# Altium schematic sheet XC6SLX09-2FTG256C.SchDoc
size A3
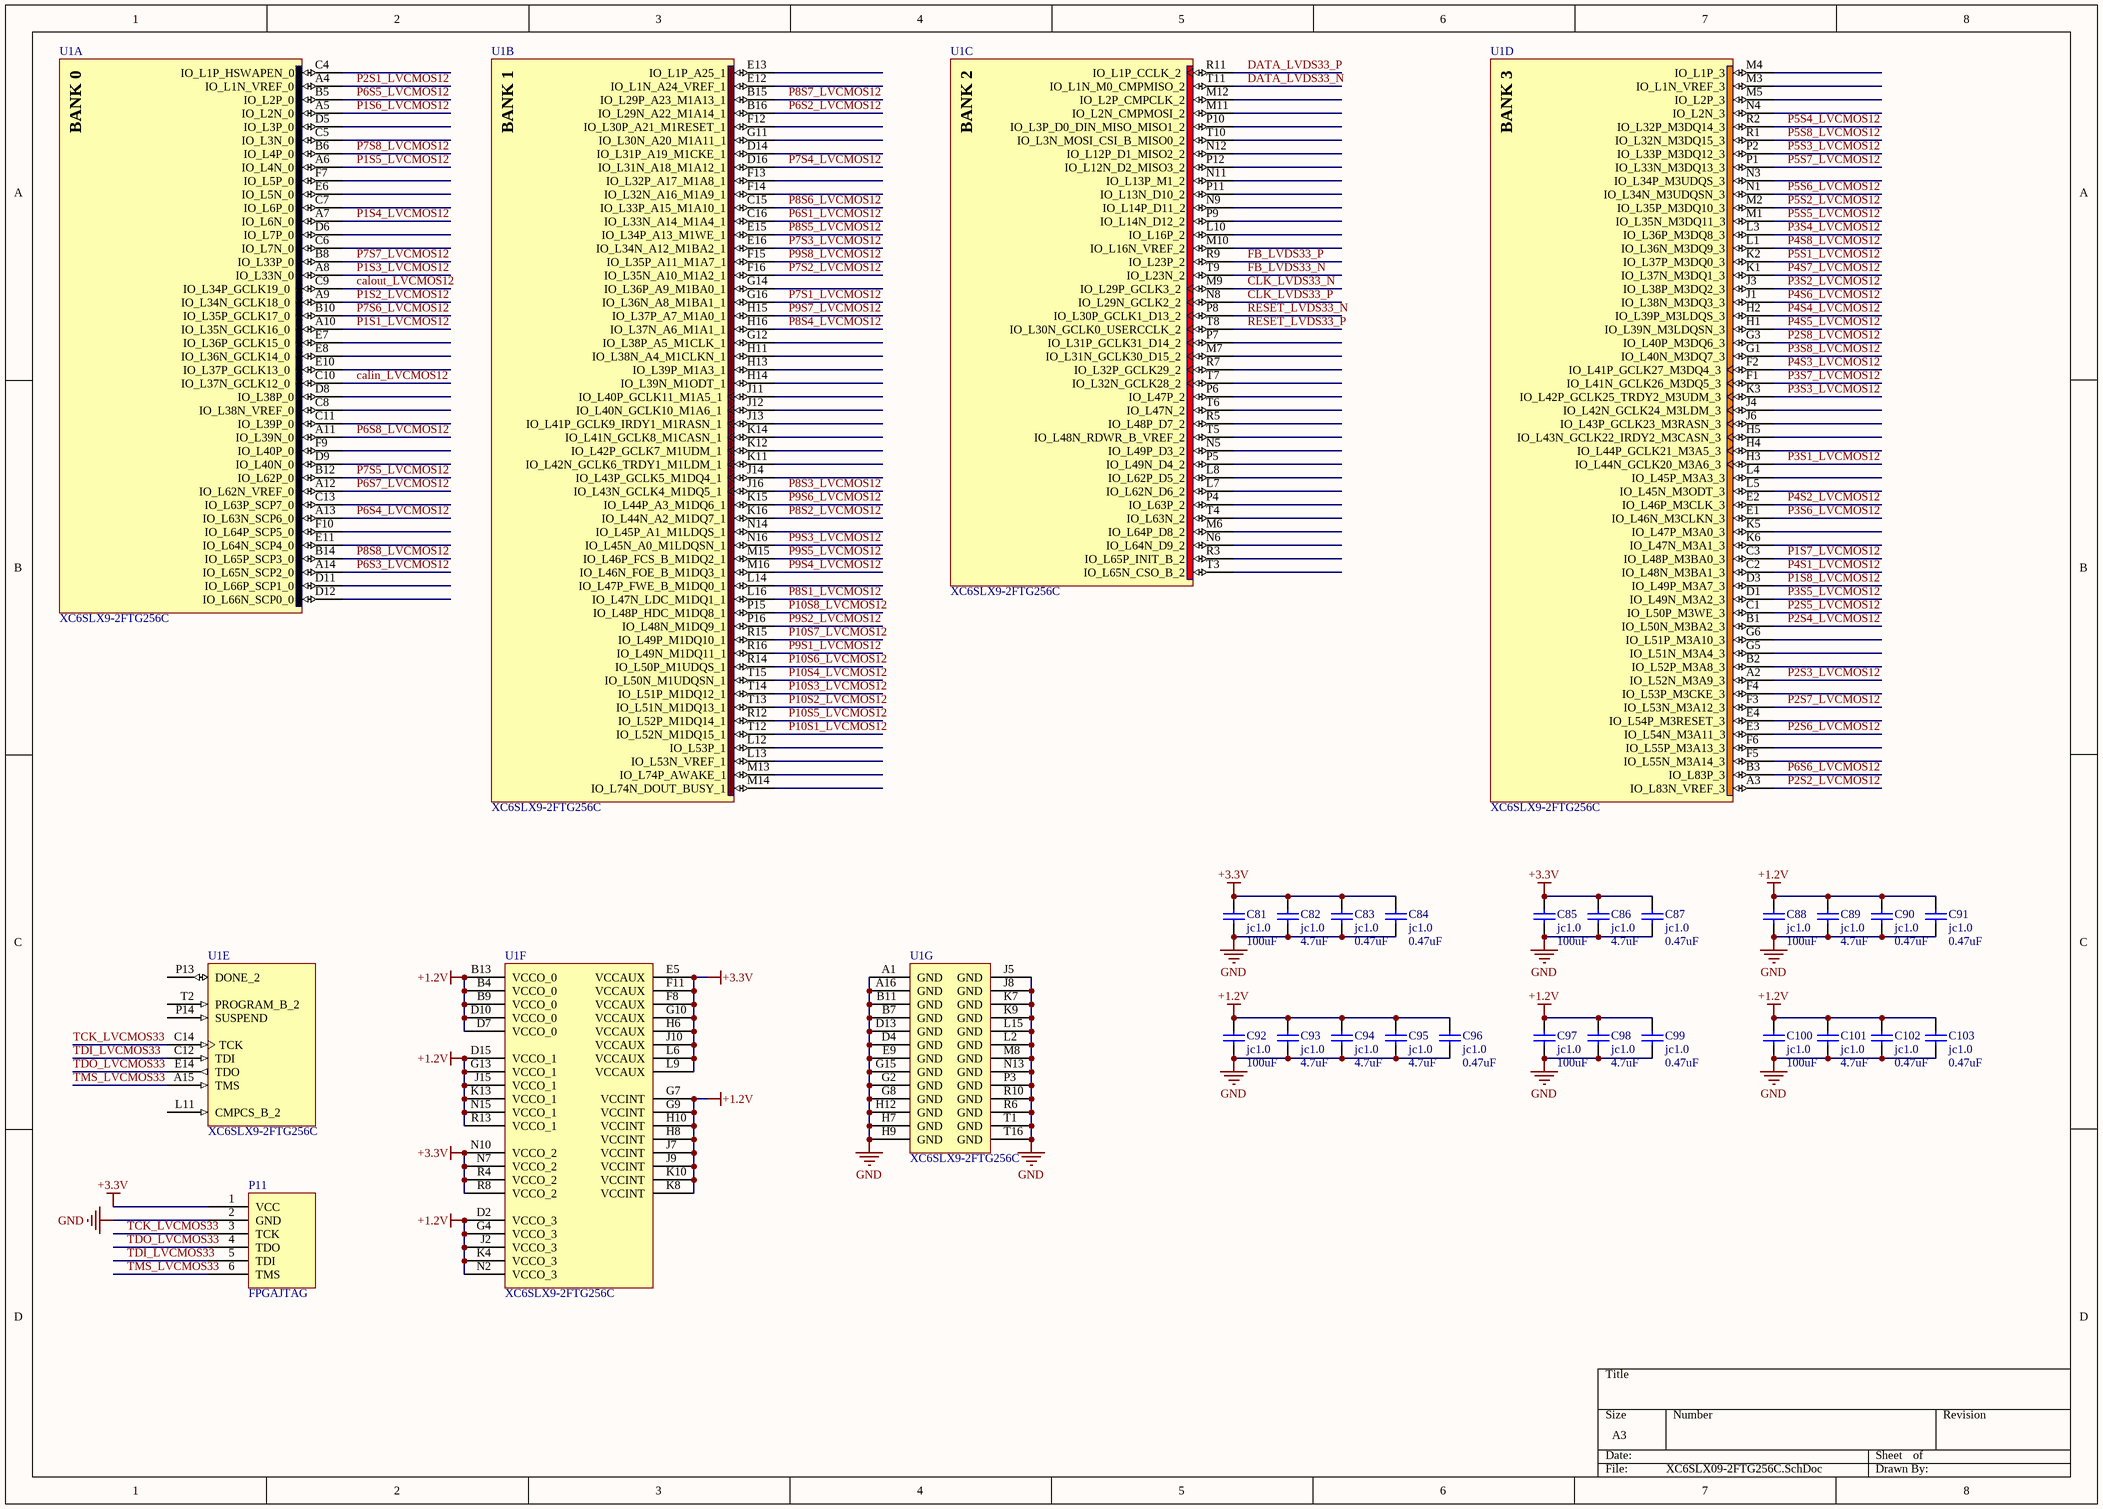
[diagram p0: XC6SLX09-2FTG256C.SchDoc]

## Parts
C81  jc1.0  value 100uF  [0805]
C82  jc1.0  value 4.7uF  [0402]
C83  jc1.0  value 0.47uF  [0402]
C84  jc1.0  value 0.47uF  [0402]
C85  jc1.0  value 100uF  [0805]
C86  jc1.0  value 4.7uF  [0402]
C87  jc1.0  value 0.47uF  [0402]
C88  jc1.0  value 100uF  [0805]
C89  jc1.0  value 4.7uF  [0402]
C90  jc1.0  value 0.47uF  [0402]
C91  jc1.0  value 0.47uF  [0402]
C92  jc1.0  value 100uF  [0805]
C93  jc1.0  value 4.7uF  [0402]
C94  jc1.0  value 4.7uF  [0402]
C95  jc1.0  value 4.7uF  [0402]
C96  jc1.0  value 0.47uF  [0402]
C97  jc1.0  value 100uF  [0805]
C98  jc1.0  value 4.7uF  [0402]
C99  jc1.0  value 0.47uF  [0402]
C100  jc1.0  value 100uF  [0805]
C101  jc1.0  value 4.7uF  [0402]
C102  jc1.0  value 0.47uF  [0402]
C103  jc1.0  value 0.47uF  [0402]
P11  FPGAJTAG  [SIP6]
U1  XC6SLX9-2FTG256C  [FTG256]  (parts A,B,C,D,E,F,G of 7)

## Nets
+1.2V: C88.2 C89.2 C90.2 C91.2 C92.2 C93.2 C94.2 C95.2 C96.2 C97.2 C98.2 C99.2 C100.2 C101.2 C102.2 C103.2 U1.B4(VCCO_0) U1.B9(VCCO_0) U1.B13(VCCO_0) U1.D2(VCCO_3) U1.D7(VCCO_0) U1.D10(VCCO_0) U1.D15(VCCO_1) U1.G4(VCCO_3) U1.G7(VCCINT) U1.G9(VCCINT) U1.G13(VCCO_1) U1.H8(VCCINT) U1.H10(VCCINT) U1.J2(VCCO_3) U1.J7(VCCINT) U1.J9(VCCINT) U1.J15(VCCO_1) U1.K4(VCCO_3) U1.K8(VCCINT) U1.K10(VCCINT) U1.K13(VCCO_1) U1.N2(VCCO_3) U1.N15(VCCO_1) U1.R13(VCCO_1)
+3.3V: C81.2 C82.2 C83.2 C84.2 C85.2 C86.2 C87.2 P11.1(VCC) U1.E5(VCCAUX) U1.F8(VCCAUX) U1.F11(VCCAUX) U1.G10(VCCAUX) U1.H6(VCCAUX) U1.J10(VCCAUX) U1.L6(VCCAUX) U1.L9(VCCAUX) U1.N7(VCCO_2) U1.N10(VCCO_2) U1.R4(VCCO_2) U1.R8(VCCO_2)
GND: C81.1 C82.1 C83.1 C84.1 C85.1 C86.1 C87.1 C88.1 C89.1 C90.1 C91.1 C92.1 C93.1 C94.1 C95.1 C96.1 C97.1 C98.1 C99.1 C100.1 C101.1 C102.1 C103.1 P11.2(GND) U1.A1(GND) U1.A16(GND) U1.B7(GND) U1.B11(GND) U1.D4(GND) U1.D13(GND) U1.E9(GND) U1.G2(GND) U1.G8(GND) U1.G15(GND) U1.H7(GND) U1.H9(GND) U1.H12(GND) U1.J5(GND) U1.J8(GND) U1.K7(GND) U1.K9(GND) U1.L2(GND) U1.L15(GND) U1.M8(GND) U1.N13(GND) U1.P3(GND) U1.R6(GND) U1.R10(GND) U1.T1(GND) U1.T16(GND)
calin_LVCMOS12: U1.C10(IO_L37N_GCLK12_0)
calout_LVCMOS12: U1.C9(IO_L34P_GCLK19_0)
CLK_LVDS33_N: U1.M9(IO_L29P_GCLK3_2)
CLK_LVDS33_P: U1.N8(IO_L29N_GCLK2_2)
DATA_LVDS33_N: U1.T11(IO_L1N_M0_CMPMISO_2)
DATA_LVDS33_P: U1.R11(IO_L1P_CCLK_2)
FB_LVDS33_N: U1.T9(IO_L23N_2)
FB_LVDS33_P: U1.R9(IO_L23P_2)
P1S1_LVCMOS12: U1.A10(IO_L35N_GCLK16_0)
P1S2_LVCMOS12: U1.A9(IO_L34N_GCLK18_0)
P1S3_LVCMOS12: U1.A8(IO_L33N_0)
P1S4_LVCMOS12: U1.A7(IO_L6N_0)
P1S5_LVCMOS12: U1.A6(IO_L4N_0)
P1S6_LVCMOS12: U1.A5(IO_L2N_0)
P1S7_LVCMOS12: U1.C3(IO_L48P_M3BA0_3)
P1S8_LVCMOS12: U1.D3(IO_L49P_M3A7_3)
P2S1_LVCMOS12: U1.A4(IO_L1N_VREF_0)
P2S2_LVCMOS12: U1.A3(IO_L83N_VREF_3)
P2S3_LVCMOS12: U1.A2(IO_L52N_M3A9_3)
P2S4_LVCMOS12: U1.B1(IO_L50N_M3BA2_3)
P2S5_LVCMOS12: U1.C1(IO_L50P_M3WE_3)
P2S6_LVCMOS12: U1.E3(IO_L54N_M3A11_3)
P2S7_LVCMOS12: U1.F3(IO_L53N_M3A12_3)
P2S8_LVCMOS12: U1.G3(IO_L40P_M3DQ6_3)
P3S1_LVCMOS12: U1.H3(IO_L44N_GCLK20_M3A6_3)
P3S2_LVCMOS12: U1.J3(IO_L38P_M3DQ2_3)
P3S3_LVCMOS12: U1.K3(IO_L42P_GCLK25_TRDY2_M3UDM_3)
P3S4_LVCMOS12: U1.L3(IO_L36P_M3DQ8_3)
P3S5_LVCMOS12: U1.D1(IO_L49N_M3A2_3)
P3S6_LVCMOS12: U1.E1(IO_L46N_M3CLKN_3)
P3S7_LVCMOS12: U1.F1(IO_L41N_GCLK26_M3DQ5_3)
P3S8_LVCMOS12: U1.G1(IO_L40N_M3DQ7_3)
P4S1_LVCMOS12: U1.C2(IO_L48N_M3BA1_3)
P4S2_LVCMOS12: U1.E2(IO_L46P_M3CLK_3)
P4S3_LVCMOS12: U1.F2(IO_L41P_GCLK27_M3DQ4_3)
P4S4_LVCMOS12: U1.H2(IO_L39P_M3LDQS_3)
P4S5_LVCMOS12: U1.H1(IO_L39N_M3LDQSN_3)
P4S6_LVCMOS12: U1.J1(IO_L38N_M3DQ3_3)
P4S7_LVCMOS12: U1.K1(IO_L37N_M3DQ1_3)
P4S8_LVCMOS12: U1.L1(IO_L36N_M3DQ9_3)
P5S1_LVCMOS12: U1.K2(IO_L37P_M3DQ0_3)
P5S2_LVCMOS12: U1.M2(IO_L35P_M3DQ10_3)
P5S3_LVCMOS12: U1.P2(IO_L33P_M3DQ12_3)
P5S4_LVCMOS12: U1.R2(IO_L32P_M3DQ14_3)
P5S5_LVCMOS12: U1.M1(IO_L35N_M3DQ11_3)
P5S6_LVCMOS12: U1.N1(IO_L34N_M3UDQSN_3)
P5S7_LVCMOS12: U1.P1(IO_L33N_M3DQ13_3)
P5S8_LVCMOS12: U1.R1(IO_L32N_M3DQ15_3)
P6S1_LVCMOS12: U1.C16(IO_L33N_A14_M1A4_1)
P6S2_LVCMOS12: U1.B16(IO_L29N_A22_M1A14_1)
P6S3_LVCMOS12: U1.A14(IO_L65N_SCP2_0)
P6S4_LVCMOS12: U1.A13(IO_L63N_SCP6_0)
P6S5_LVCMOS12: U1.B5(IO_L2P_0)
P6S6_LVCMOS12: U1.B3(IO_L83P_3)
P6S7_LVCMOS12: U1.A12(IO_L62N_VREF_0)
P6S8_LVCMOS12: U1.A11(IO_L39N_0)
P7S1_LVCMOS12: U1.G16(IO_L36N_A8_M1BA1_1)
P7S2_LVCMOS12: U1.F16(IO_L35N_A10_M1A2_1)
P7S3_LVCMOS12: U1.E16(IO_L34N_A12_M1BA2_1)
P7S4_LVCMOS12: U1.D16(IO_L31N_A18_M1A12_1)
P7S5_LVCMOS12: U1.B12(IO_L62P_0)
P7S6_LVCMOS12: U1.B10(IO_L35P_GCLK17_0)
P7S7_LVCMOS12: U1.B8(IO_L33P_0)
P7S8_LVCMOS12: U1.B6(IO_L4P_0)
P8S1_LVCMOS12: U1.L16(IO_L47N_LDC_M1DQ1_1)
P8S2_LVCMOS12: U1.K16(IO_L44N_A2_M1DQ7_1)
P8S3_LVCMOS12: U1.J16(IO_L43N_GCLK4_M1DQ5_1)
P8S4_LVCMOS12: U1.H16(IO_L37N_A6_M1A1_1)
P8S5_LVCMOS12: U1.E15(IO_L34P_A13_M1WE_1)
P8S6_LVCMOS12: U1.C15(IO_L33P_A15_M1A10_1)
P8S7_LVCMOS12: U1.B15(IO_L29P_A23_M1A13_1)
P8S8_LVCMOS12: U1.B14(IO_L65P_SCP3_0)
P9S1_LVCMOS12: U1.R16(IO_L49N_M1DQ11_1)
P9S2_LVCMOS12: U1.P16(IO_L48N_M1DQ9_1)
P9S3_LVCMOS12: U1.N16(IO_L45N_A0_M1LDQSN_1)
P9S4_LVCMOS12: U1.M16(IO_L46N_FOE_B_M1DQ3_1)
P9S5_LVCMOS12: U1.M15(IO_L46P_FCS_B_M1DQ2_1)
P9S6_LVCMOS12: U1.K15(IO_L44P_A3_M1DQ6_1)
P9S7_LVCMOS12: U1.H15(IO_L37P_A7_M1A0_1)
P9S8_LVCMOS12: U1.F15(IO_L35P_A11_M1A7_1)
P10S1_LVCMOS12: U1.T12(IO_L52N_M1DQ15_1)
P10S2_LVCMOS12: U1.T13(IO_L51N_M1DQ13_1)
P10S3_LVCMOS12: U1.T14(IO_L51P_M1DQ12_1)
P10S4_LVCMOS12: U1.T15(IO_L50N_M1UDQSN_1)
P10S5_LVCMOS12: U1.R12(IO_L52P_M1DQ14_1)
P10S6_LVCMOS12: U1.R14(IO_L50P_M1UDQS_1)
P10S7_LVCMOS12: U1.R15(IO_L49P_M1DQ10_1)
P10S8_LVCMOS12: U1.P15(IO_L48P_HDC_M1DQ8_1)
RESET_LVDS33_N: U1.P8(IO_L30P_GCLK1_D13_2)
RESET_LVDS33_P: U1.T8(IO_L30N_GCLK0_USERCCLK_2)
TCK_LVCMOS33: P11.3(TCK) U1.C14(TCK)
TDI_LVCMOS33: P11.5(TDI) U1.C12(TDI)
TDO_LVCMOS33: P11.4(TDO) U1.E14(TDO)
TMS_LVCMOS33: P11.6(TMS) U1.A15(TMS)

Not connected (* = marked no-connect by the designer): U1 B2(IO_L52P_M3A8_3) C4(IO_L1P_HSWAPEN_0) C5(IO_L3N_0) C6(IO_L7N_0) C7(IO_L6P_0) C8(IO_L38N_VREF_0) C11(IO_L39P_0) C13(IO_L63P_SCP7_0) D5(IO_L3P_0) D6(IO_L7P_0) D8(IO_L38P_0) D9(IO_L40N_0) D11(IO_L66P_SCP1_0) D12(IO_L66N_SCP0_0) D14(IO_L31P_A19_M1CKE_1) E4(IO_L54P_M3RESET_3) E6(IO_L5N_0) E7(IO_L36P_GCLK15_0) E8(IO_L36N_GCLK14_0) E10(IO_L37P_GCLK13_0) E11(IO_L64N_SCP4_0) E12(IO_L1N_A24_VREF_1) E13(IO_L1P_A25_1) F4(IO_L53P_M3CKE_3) F5(IO_L55N_M3A14_3) F6(IO_L55P_M3A13_3) F7(IO_L5P_0) F9(IO_L40P_0) F10(IO_L64P_SCP5_0) F12(IO_L30P_A21_M1RESET_1) F13(IO_L32P_A17_M1A8_1) F14(IO_L32N_A16_M1A9_1) G5(IO_L51N_M3A4_3) G6(IO_L51P_M3A10_3) G11(IO_L30N_A20_M1A11_1) G12(IO_L38P_A5_M1CLK_1) G14(IO_L36P_A9_M1BA0_1) H4(IO_L44P_GCLK21_M3A5_3) H5(IO_L43N_GCLK22_IRDY2_M3CASN_3) H11(IO_L38N_A4_M1CLKN_1) H13(IO_L39P_M1A3_1) H14(IO_L39N_M1ODT_1) J4(IO_L42N_GCLK24_M3LDM_3) J6(IO_L43P_GCLK23_M3RASN_3) J11(IO_L40P_GCLK11_M1A5_1) J12(IO_L40N_GCLK10_M1A6_1) J13(IO_L41P_GCLK9_IRDY1_M1RASN_1) J14(IO_L43P_GCLK5_M1DQ4_1) K5(IO_L47P_M3A0_3) K6(IO_L47N_M3A1_3) K11(IO_L42N_GCLK6_TRDY1_M1LDM_1) K12(IO_L42P_GCLK7_M1UDM_1) K14(IO_L41N_GCLK8_M1CASN_1) L4(IO_L45P_M3A3_3) L5(IO_L45N_M3ODT_3) L7(IO_L62N_D6_2) L8(IO_L62P_D5_2) L10(IO_L16P_2) L11(CMPCS_B_2) L12(IO_L53P_1) L13(IO_L53N_VREF_1) L14(IO_L47P_FWE_B_M1DQ0_1) M3(IO_L1N_VREF_3) M4(IO_L1P_3) M5(IO_L2P_3) M6(IO_L64P_D8_2) M7(IO_L31N_GCLK30_D15_2) M10(IO_L16N_VREF_2) M11(IO_L2N_CMPMOSI_2) M12(IO_L2P_CMPCLK_2) M13(IO_L74P_AWAKE_1) M14(IO_L74N_DOUT_BUSY_1) N3(IO_L34P_M3UDQS_3) N4(IO_L2N_3) N5(IO_L49P_D3_2) N6(IO_L64N_D9_2) N9(IO_L14P_D11_2) N11(IO_L13P_M1_2) N12(IO_L12P_D1_MISO2_2) N14(IO_L45P_A1_M1LDQS_1) P4(IO_L63P_2) P5(IO_L49N_D4_2) P6(IO_L47P_2) P7(IO_L31P_GCLK31_D14_2) P9(IO_L14N_D12_2) P10(IO_L3P_D0_DIN_MISO_MISO1_2) P11(IO_L13N_D10_2) P12(IO_L12N_D2_MISO3_2) P13(DONE_2) P14(SUSPEND) R3(IO_L65P_INIT_B_2) R5(IO_L48P_D7_2) R7(IO_L32P_GCLK29_2) T2(PROGRAM_B_2) T3(IO_L65N_CSO_B_2) T4(IO_L63N_2) T5(IO_L48N_RDWR_B_VREF_2) T6(IO_L47N_2) T7(IO_L32N_GCLK28_2) T10(IO_L3N_MOSI_CSI_B_MISO0_2)

## Notes on the sheet
- (in symbol XC6SLX9-2FTG256C, part A) BANK 0
- (in symbol XC6SLX9-2FTG256C, part B) BANK 1
- (in symbol XC6SLX9-2FTG256C, part C) BANK 2
- (in symbol XC6SLX9-2FTG256C, part D) BANK 3

## Library data of the parts
C81-C103 = Cap: Capacitor; Published: 8-Jun-2000; LatestRevisionDate: 17-Jul-2002; LatestRevisionNote: Re-released for DXP Platform.; PackageReference: RAD-0.3; Publisher: Altium Limited
P11 = FPGAJTAGHEADER
U1 = XC6SLX9-2FTG256C: Spartan-6 LX 1.2V FPGA, 186 User I/Os, 256-Ball Fine-Pitch Thin BGA (1.0mm Pitch), Speed Grade 2, Commercial Grade, Pb-Free; DatasheetVersion: ver1.6, Nov-2010; PackageVersion: ver1.3, Oct-2007; PackageReference: FTG256; PackageDescription: 256-Ball Fine Pitch Thin Ball Grid Array 1.00 mm Pitch (FTG256) - Pb-Free; Code_JEDEC: MS-034-AAF-1*; ComponentLink1Description: Manufacturer URL; ComponentLink1URL: http://www.xilinx.com/; ComponentLink2Description: Spartan-6 Datasheet; ComponentLink2URL: http://www.xilinx.com/support/documentation/data_sheets/ds160.pdf; ComponentLink3Description: Spartan-6 Documents; ComponentLink3URL: http://www.xilinx.com/support/documentation/spartan-6.htm